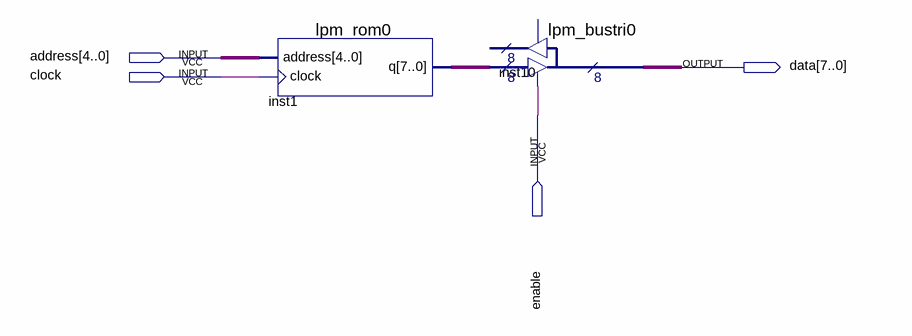
[diagram p0: schematic sheet]
// Quartus schematic ROM.bdf as structural Verilog: 2 symbols, 4 pins
module ROM (
  input  [4:0] address,
  input  clock,
  input  enable,
  output [7:0] data
);

  wire [7:0] inst1_q;

  lpm_rom0 inst1 (.address(address), .clock(clock), .q(inst1_q));
  lpm_bustri0 inst10 (.enabledt(enable), .data(inst1_q), .tridata(data));  // open: enabletr, result
endmodule
